# Altium schematic sheet 1VFAT_OH1_OCT1.SchDoc
size 420 x 297 mm
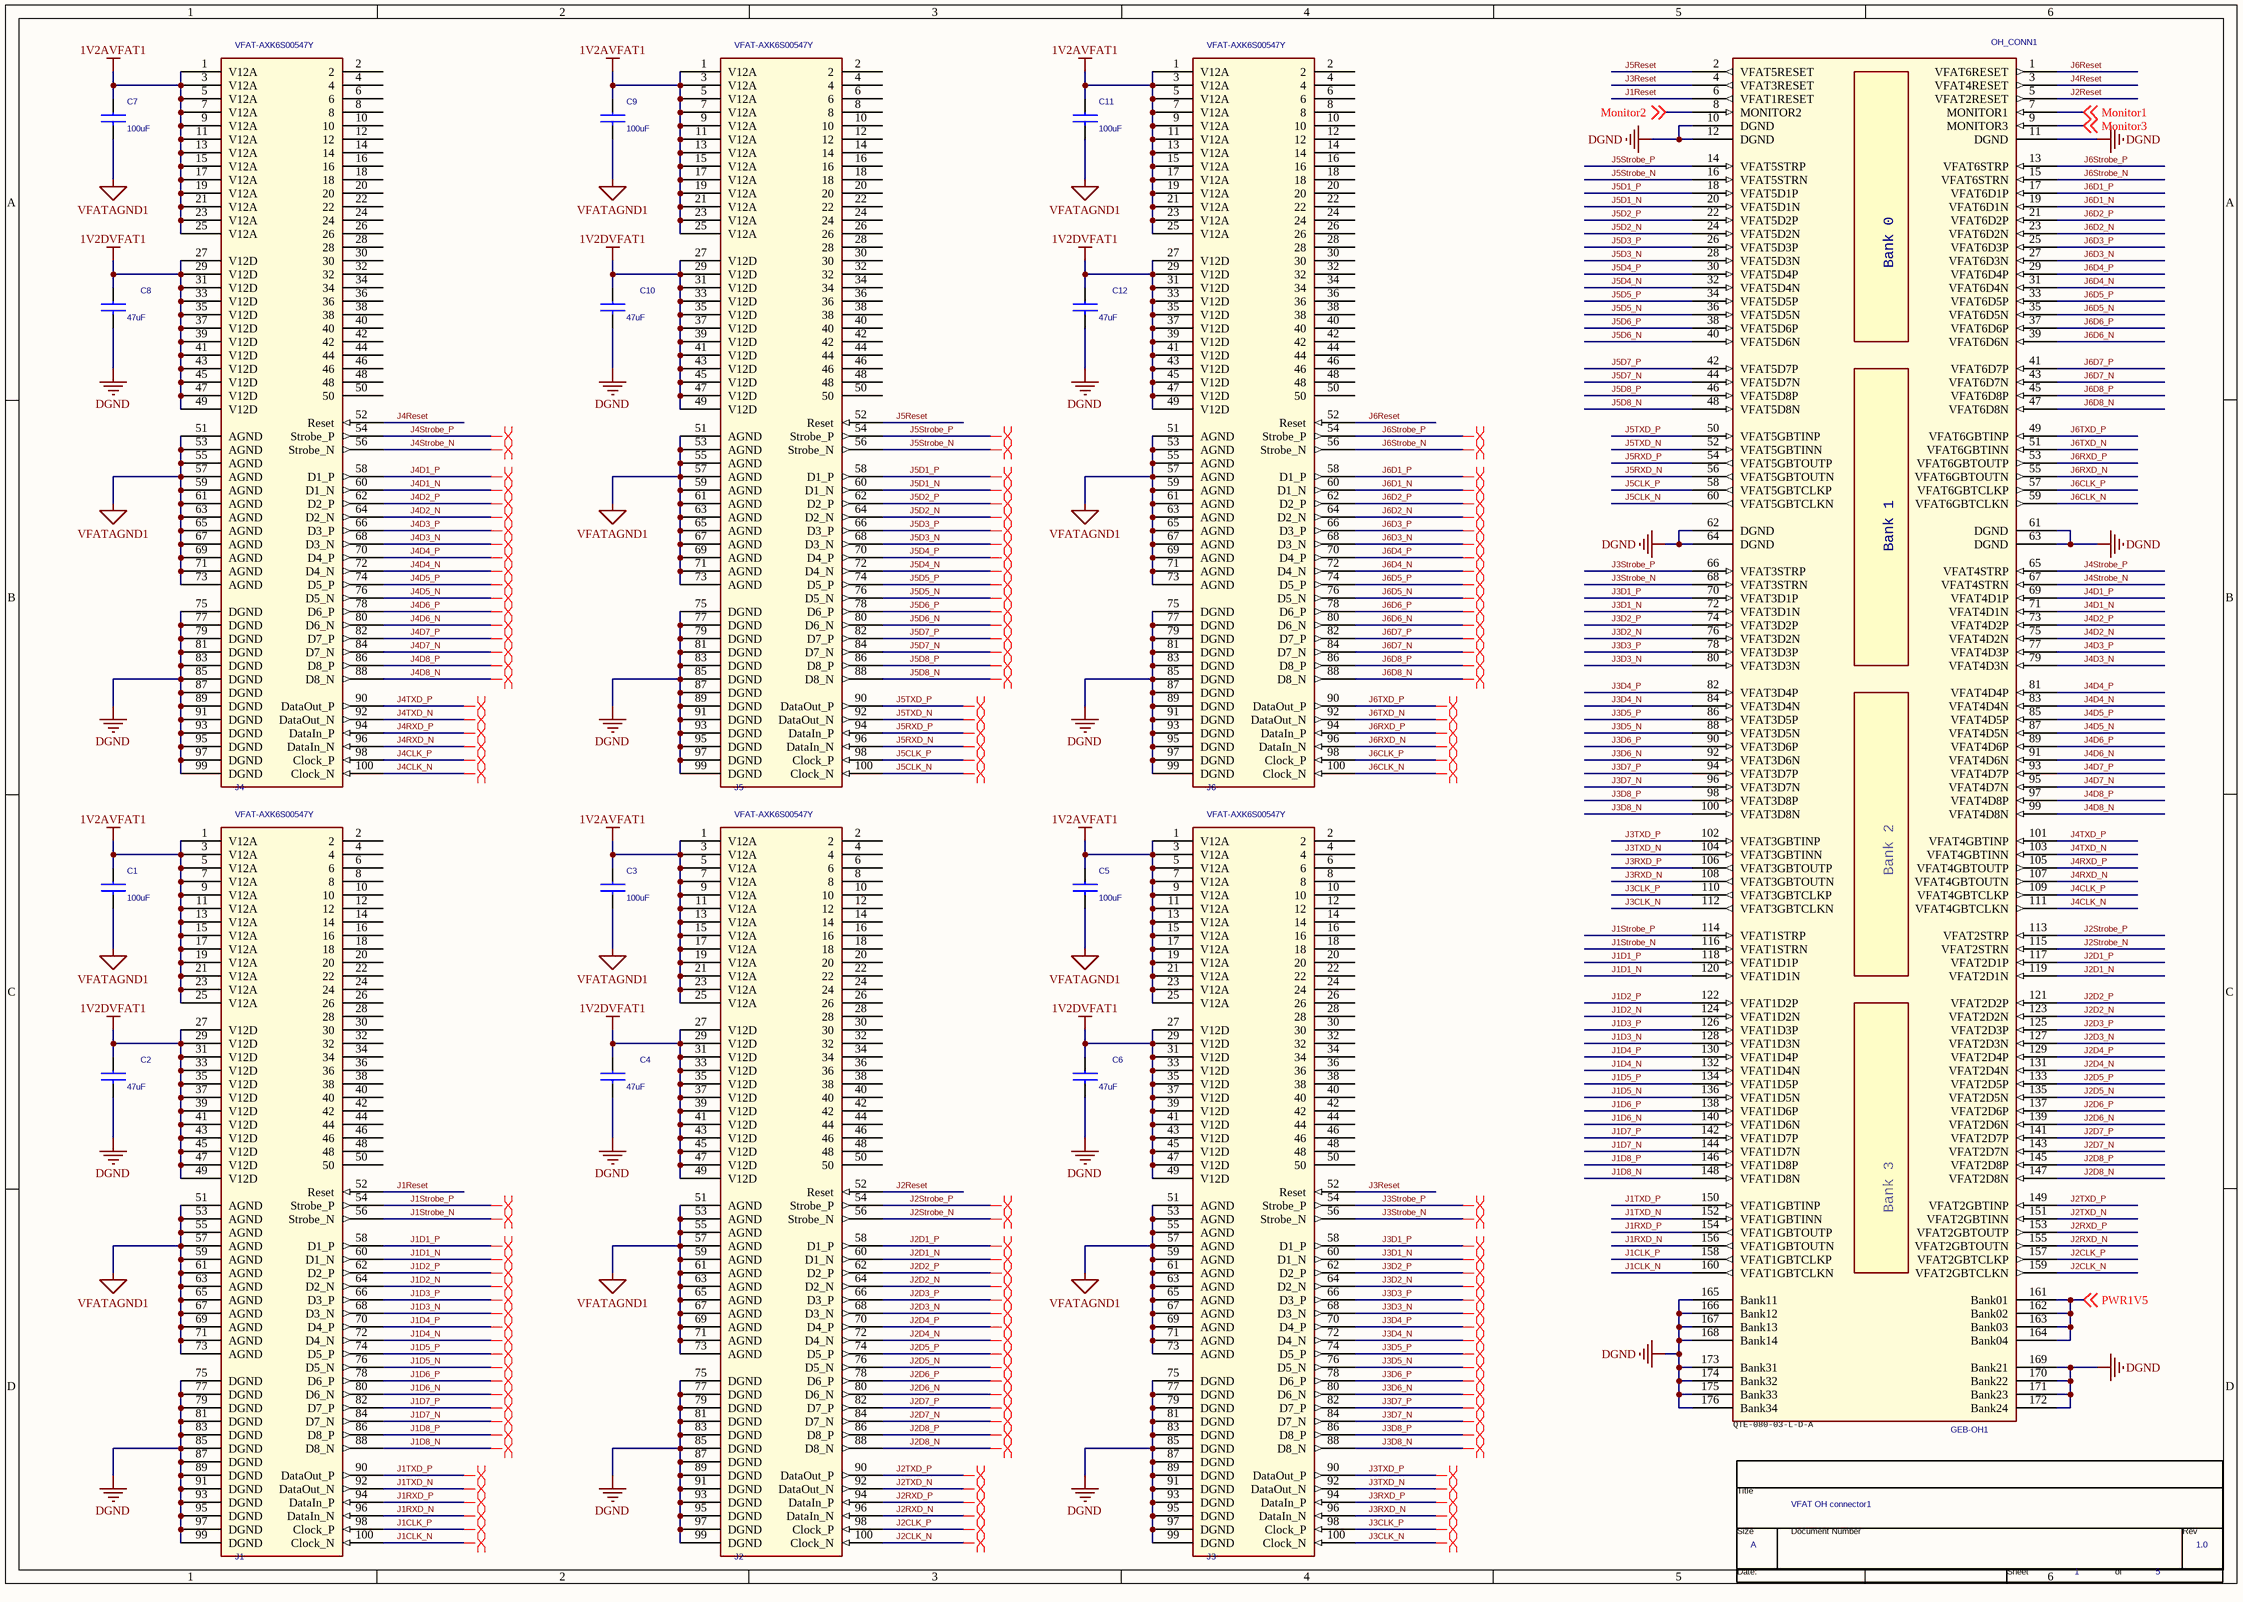
[diagram p0: 1VFAT_OH1_OCT1.SchDoc]

## Parts
*  Page Count: 5  Page Number: 1  Page Size: A  Title: VFAT OH connector1  RevCode: 1.0  (hidden comment: TitleBlock0)  (graphical)
C1  100uF  [C1210]
C2  47uF  [C1206]
C3  100uF  [C1210]
C4  47uF  [C1206]
C5  100uF  [C1210]
C6  47uF  [C1206]
C7  100uF  [C1210]
C8  47uF  [C1206]
C9  100uF  [C1210]
C10  47uF  [C1206]
C11  100uF  [C1210]
C12  47uF  [C1206]
J1  VFAT-AXK6S00547Y  [panasonic100]
J2  VFAT-AXK6S00547Y  [panasonic100]
J3  VFAT-AXK6S00547Y  [panasonic100]
J4  VFAT-AXK6S00547Y  [panasonic100]
J5  VFAT-AXK6S00547Y  [panasonic100]
J6  VFAT-AXK6S00547Y  [panasonic100]
OH_CONN1  GEB-OH1  [samtec160]

## Nets
1V2AVFAT1: C1.1 C3.1 C5.1 C7.1 C9.1 C11.1 J1.1(V12A) J1.3(V12A) J1.5(V12A) J1.7(V12A) J1.9(V12A) J1.11(V12A) J1.13(V12A) J1.15(V12A) J1.17(V12A) J1.19(V12A) J1.21(V12A) J1.23(V12A) J1.25(V12A) J2.1(V12A) J2.3(V12A) J2.5(V12A) J2.7(V12A) J2.9(V12A) J2.11(V12A) J2.13(V12A) J2.15(V12A) J2.17(V12A) J2.19(V12A) J2.21(V12A) J2.23(V12A) J2.25(V12A) J3.1(V12A) J3.3(V12A) J3.5(V12A) J3.7(V12A) J3.9(V12A) J3.11(V12A) J3.13(V12A) J3.15(V12A) J3.17(V12A) J3.19(V12A) J3.21(V12A) J3.23(V12A) J3.25(V12A) J4.1(V12A) J4.3(V12A) J4.5(V12A) J4.7(V12A) J4.9(V12A) J4.11(V12A) J4.13(V12A) J4.15(V12A) J4.17(V12A) J4.19(V12A) J4.21(V12A) J4.23(V12A) J4.25(V12A) J5.1(V12A) J5.3(V12A) J5.5(V12A) J5.7(V12A) J5.9(V12A) J5.11(V12A) J5.13(V12A) J5.15(V12A) J5.17(V12A) J5.19(V12A) J5.21(V12A) J5.23(V12A) J5.25(V12A) J6.1(V12A) J6.3(V12A) J6.5(V12A) J6.7(V12A) J6.9(V12A) J6.11(V12A) J6.13(V12A) J6.15(V12A) J6.17(V12A) J6.19(V12A) J6.21(V12A) J6.23(V12A) J6.25(V12A)
1V2DVFAT1: C2.1 C4.1 C6.1 C8.1 C10.1 C12.1 J1.27(V12D) J1.29(V12D) J1.31(V12D) J1.33(V12D) J1.35(V12D) J1.37(V12D) J1.39(V12D) J1.41(V12D) J1.43(V12D) J1.45(V12D) J1.47(V12D) J1.49(V12D) J2.27(V12D) J2.29(V12D) J2.31(V12D) J2.33(V12D) J2.35(V12D) J2.37(V12D) J2.39(V12D) J2.41(V12D) J2.43(V12D) J2.45(V12D) J2.47(V12D) J2.49(V12D) J3.27(V12D) J3.29(V12D) J3.31(V12D) J3.33(V12D) J3.35(V12D) J3.37(V12D) J3.39(V12D) J3.41(V12D) J3.43(V12D) J3.45(V12D) J3.47(V12D) J3.49(V12D) J4.27(V12D) J4.29(V12D) J4.31(V12D) J4.33(V12D) J4.35(V12D) J4.37(V12D) J4.39(V12D) J4.41(V12D) J4.43(V12D) J4.45(V12D) J4.47(V12D) J4.49(V12D) J5.27(V12D) J5.29(V12D) J5.31(V12D) J5.33(V12D) J5.35(V12D) J5.37(V12D) J5.39(V12D) J5.41(V12D) J5.43(V12D) J5.45(V12D) J5.47(V12D) J5.49(V12D) J6.27(V12D) J6.29(V12D) J6.31(V12D) J6.33(V12D) J6.35(V12D) J6.37(V12D) J6.39(V12D) J6.41(V12D) J6.43(V12D) J6.45(V12D) J6.47(V12D) J6.49(V12D)
DGND: C2.2 C4.2 C6.2 C8.2 C10.2 C12.2 J1.75(DGND) J1.77(DGND) J1.79(DGND) J1.81(DGND) J1.83(DGND) J1.85(DGND) J1.87(DGND) J1.89(DGND) J1.91(DGND) J1.93(DGND) J1.95(DGND) J1.97(DGND) J1.99(DGND) J2.75(DGND) J2.77(DGND) J2.79(DGND) J2.81(DGND) J2.83(DGND) J2.85(DGND) J2.87(DGND) J2.89(DGND) J2.91(DGND) J2.93(DGND) J2.95(DGND) J2.97(DGND) J2.99(DGND) J3.75(DGND) J3.77(DGND) J3.79(DGND) J3.81(DGND) J3.83(DGND) J3.85(DGND) J3.87(DGND) J3.89(DGND) J3.91(DGND) J3.93(DGND) J3.95(DGND) J3.97(DGND) J3.99(DGND) J4.75(DGND) J4.77(DGND) J4.79(DGND) J4.81(DGND) J4.83(DGND) J4.85(DGND) J4.87(DGND) J4.89(DGND) J4.91(DGND) J4.93(DGND) J4.95(DGND) J4.97(DGND) J4.99(DGND) J5.75(DGND) J5.77(DGND) J5.79(DGND) J5.81(DGND) J5.83(DGND) J5.85(DGND) J5.87(DGND) J5.89(DGND) J5.91(DGND) J5.93(DGND) J5.95(DGND) J5.97(DGND) J5.99(DGND) J6.75(DGND) J6.77(DGND) J6.79(DGND) J6.81(DGND) J6.83(DGND) J6.85(DGND) J6.87(DGND) J6.89(DGND) J6.91(DGND) J6.93(DGND) J6.95(DGND) J6.97(DGND) J6.99(DGND) OH_CONN1.10(DGND) OH_CONN1.11(DGND) OH_CONN1.12(DGND) OH_CONN1.61(DGND) OH_CONN1.62(DGND) OH_CONN1.63(DGND) OH_CONN1.64(DGND) OH_CONN1.165(Bank11) OH_CONN1.166(Bank12) OH_CONN1.167(Bank13) OH_CONN1.168(Bank14) OH_CONN1.169(Bank21) OH_CONN1.170(Bank22) OH_CONN1.171(Bank23) OH_CONN1.172(Bank24) OH_CONN1.173(Bank31) OH_CONN1.174(Bank32) OH_CONN1.175(Bank33) OH_CONN1.176(Bank34)
VFATAGND1: C1.2 C3.2 C5.2 C7.2 C9.2 C11.2 J1.51(AGND) J1.53(AGND) J1.55(AGND) J1.57(AGND) J1.59(AGND) J1.61(AGND) J1.63(AGND) J1.65(AGND) J1.67(AGND) J1.69(AGND) J1.71(AGND) J1.73(AGND) J2.51(AGND) J2.53(AGND) J2.55(AGND) J2.57(AGND) J2.59(AGND) J2.61(AGND) J2.63(AGND) J2.65(AGND) J2.67(AGND) J2.69(AGND) J2.71(AGND) J2.73(AGND) J3.51(AGND) J3.53(AGND) J3.55(AGND) J3.57(AGND) J3.59(AGND) J3.61(AGND) J3.63(AGND) J3.65(AGND) J3.67(AGND) J3.69(AGND) J3.71(AGND) J3.73(AGND) J4.51(AGND) J4.53(AGND) J4.55(AGND) J4.57(AGND) J4.59(AGND) J4.61(AGND) J4.63(AGND) J4.65(AGND) J4.67(AGND) J4.69(AGND) J4.71(AGND) J4.73(AGND) J5.51(AGND) J5.53(AGND) J5.55(AGND) J5.57(AGND) J5.59(AGND) J5.61(AGND) J5.63(AGND) J5.65(AGND) J5.67(AGND) J5.69(AGND) J5.71(AGND) J5.73(AGND) J6.51(AGND) J6.53(AGND) J6.55(AGND) J6.57(AGND) J6.59(AGND) J6.61(AGND) J6.63(AGND) J6.65(AGND) J6.67(AGND) J6.69(AGND) J6.71(AGND) J6.73(AGND)
J1CLK_N: J1.100(Clock_N) OH_CONN1.160(VFAT1GBTCLKN)
J1CLK_P: J1.98(Clock_P) OH_CONN1.158(VFAT1GBTCLKP)
J1D1_N: J1.60(D1_N) OH_CONN1.120(VFAT1D1N)
J1D1_P: J1.58(D1_P) OH_CONN1.118(VFAT1D1P)
J1D2_N: J1.64(D2_N) OH_CONN1.124(VFAT1D2N)
J1D2_P: J1.62(D2_P) OH_CONN1.122(VFAT1D2P)
J1D3_N: J1.68(D3_N) OH_CONN1.128(VFAT1D3N)
J1D3_P: J1.66(D3_P) OH_CONN1.126(VFAT1D3P)
J1D4_N: J1.72(D4_N) OH_CONN1.132(VFAT1D4N)
J1D4_P: J1.70(D4_P) OH_CONN1.130(VFAT1D4P)
J1D5_N: J1.76(D5_N) OH_CONN1.136(VFAT1D5N)
J1D5_P: J1.74(D5_P) OH_CONN1.134(VFAT1D5P)
J1D6_N: J1.80(D6_N) OH_CONN1.140(VFAT1D6N)
J1D6_P: J1.78(D6_P) OH_CONN1.138(VFAT1D6P)
J1D7_N: J1.84(D7_N) OH_CONN1.144(VFAT1D7N)
J1D7_P: J1.82(D7_P) OH_CONN1.142(VFAT1D7P)
J1D8_N: J1.88(D8_N) OH_CONN1.148(VFAT1D8N)
J1D8_P: J1.86(D8_P) OH_CONN1.146(VFAT1D8P)
J1Reset: J1.52(Reset) OH_CONN1.6(VFAT1RESET)
J1RXD_N: J1.96(DataIn_N) OH_CONN1.156(VFAT1GBTOUTN)
J1RXD_P: J1.94(DataIn_P) OH_CONN1.154(VFAT1GBTOUTP)
J1Strobe_N: J1.56(Strobe_N) OH_CONN1.116(VFAT1STRN)
J1Strobe_P: J1.54(Strobe_P) OH_CONN1.114(VFAT1STRP)
J1TXD_N: J1.92(DataOut_N) OH_CONN1.152(VFAT1GBTINN)
J1TXD_P: J1.90(DataOut_P) OH_CONN1.150(VFAT1GBTINP)
J2CLK_N: J2.100(Clock_N) OH_CONN1.159(VFAT2GBTCLKN)
J2CLK_P: J2.98(Clock_P) OH_CONN1.157(VFAT2GBTCLKP)
J2D1_N: J2.60(D1_N) OH_CONN1.119(VFAT2D1N)
J2D1_P: J2.58(D1_P) OH_CONN1.117(VFAT2D1P)
J2D2_N: J2.64(D2_N) OH_CONN1.123(VFAT2D2N)
J2D2_P: J2.62(D2_P) OH_CONN1.121(VFAT2D2P)
J2D3_N: J2.68(D3_N) OH_CONN1.127(VFAT2D3N)
J2D3_P: J2.66(D3_P) OH_CONN1.125(VFAT2D3P)
J2D4_N: J2.72(D4_N) OH_CONN1.131(VFAT2D4N)
J2D4_P: J2.70(D4_P) OH_CONN1.129(VFAT2D4P)
J2D5_N: J2.76(D5_N) OH_CONN1.135(VFAT2D5N)
J2D5_P: J2.74(D5_P) OH_CONN1.133(VFAT2D5P)
J2D6_N: J2.80(D6_N) OH_CONN1.139(VFAT2D6N)
J2D6_P: J2.78(D6_P) OH_CONN1.137(VFAT2D6P)
J2D7_N: J2.84(D7_N) OH_CONN1.143(VFAT2D7N)
J2D7_P: J2.82(D7_P) OH_CONN1.141(VFAT2D7P)
J2D8_N: J2.88(D8_N) OH_CONN1.147(VFAT2D8N)
J2D8_P: J2.86(D8_P) OH_CONN1.145(VFAT2D8P)
J2Reset: J2.52(Reset) OH_CONN1.5(VFAT2RESET)
J2RXD_N: J2.96(DataIn_N) OH_CONN1.155(VFAT2GBTOUTN)
J2RXD_P: J2.94(DataIn_P) OH_CONN1.153(VFAT2GBTOUTP)
J2Strobe_N: J2.56(Strobe_N) OH_CONN1.115(VFAT2STRN)
J2Strobe_P: J2.54(Strobe_P) OH_CONN1.113(VFAT2STRP)
J2TXD_N: J2.92(DataOut_N) OH_CONN1.151(VFAT2GBTINN)
J2TXD_P: J2.90(DataOut_P) OH_CONN1.149(VFAT2GBTINP)
J3CLK_N: J3.100(Clock_N) OH_CONN1.112(VFAT3GBTCLKN)
J3CLK_P: J3.98(Clock_P) OH_CONN1.110(VFAT3GBTCLKP)
J3D1_N: J3.60(D1_N) OH_CONN1.72(VFAT3D1N)
J3D1_P: J3.58(D1_P) OH_CONN1.70(VFAT3D1P)
J3D2_N: J3.64(D2_N) OH_CONN1.76(VFAT3D2N)
J3D2_P: J3.62(D2_P) OH_CONN1.74(VFAT3D2P)
J3D3_N: J3.68(D3_N) OH_CONN1.80(VFAT3D3N)
J3D3_P: J3.66(D3_P) OH_CONN1.78(VFAT3D3P)
J3D4_N: J3.72(D4_N) OH_CONN1.84(VFAT3D4N)
J3D4_P: J3.70(D4_P) OH_CONN1.82(VFAT3D4P)
J3D5_N: J3.76(D5_N) OH_CONN1.88(VFAT3D5N)
J3D5_P: J3.74(D5_P) OH_CONN1.86(VFAT3D5P)
J3D6_N: J3.80(D6_N) OH_CONN1.92(VFAT3D6N)
J3D6_P: J3.78(D6_P) OH_CONN1.90(VFAT3D6P)
J3D7_N: J3.84(D7_N) OH_CONN1.96(VFAT3D7N)
J3D7_P: J3.82(D7_P) OH_CONN1.94(VFAT3D7P)
J3D8_N: J3.88(D8_N) OH_CONN1.100(VFAT3D8N)
J3D8_P: J3.86(D8_P) OH_CONN1.98(VFAT3D8P)
J3Reset: J3.52(Reset) OH_CONN1.4(VFAT3RESET)
J3RXD_N: J3.96(DataIn_N) OH_CONN1.108(VFAT3GBTOUTN)
J3RXD_P: J3.94(DataIn_P) OH_CONN1.106(VFAT3GBTOUTP)
J3Strobe_N: J3.56(Strobe_N) OH_CONN1.68(VFAT3STRN)
J3Strobe_P: J3.54(Strobe_P) OH_CONN1.66(VFAT3STRP)
J3TXD_N: J3.92(DataOut_N) OH_CONN1.104(VFAT3GBTINN)
J3TXD_P: J3.90(DataOut_P) OH_CONN1.102(VFAT3GBTINP)
J4CLK_N: J4.100(Clock_N) OH_CONN1.111(VFAT4GBTCLKN)
J4CLK_P: J4.98(Clock_P) OH_CONN1.109(VFAT4GBTCLKP)
J4D1_N: J4.60(D1_N) OH_CONN1.71(VFAT4D1N)
J4D1_P: J4.58(D1_P) OH_CONN1.69(VFAT4D1P)
J4D2_N: J4.64(D2_N) OH_CONN1.75(VFAT4D2N)
J4D2_P: J4.62(D2_P) OH_CONN1.73(VFAT4D2P)
J4D3_N: J4.68(D3_N) OH_CONN1.79(VFAT4D3N)
J4D3_P: J4.66(D3_P) OH_CONN1.77(VFAT4D3P)
J4D4_N: J4.72(D4_N) OH_CONN1.83(VFAT4D4N)
J4D4_P: J4.70(D4_P) OH_CONN1.81(VFAT4D4P)
J4D5_N: J4.76(D5_N) OH_CONN1.87(VFAT4D5N)
J4D5_P: J4.74(D5_P) OH_CONN1.85(VFAT4D5P)
J4D6_N: J4.80(D6_N) OH_CONN1.91(VFAT4D6N)
J4D6_P: J4.78(D6_P) OH_CONN1.89(VFAT4D6P)
J4D7_N: J4.84(D7_N) OH_CONN1.95(VFAT4D7N)
J4D7_P: J4.82(D7_P) OH_CONN1.93(VFAT4D7P)
J4D8_N: J4.88(D8_N) OH_CONN1.99(VFAT4D8N)
J4D8_P: J4.86(D8_P) OH_CONN1.97(VFAT4D8P)
J4Reset: J4.52(Reset) OH_CONN1.3(VFAT4RESET)
J4RXD_N: J4.96(DataIn_N) OH_CONN1.107(VFAT4GBTOUTN)
J4RXD_P: J4.94(DataIn_P) OH_CONN1.105(VFAT4GBTOUTP)
J4Strobe_N: J4.56(Strobe_N) OH_CONN1.67(VFAT4STRN)
J4Strobe_P: J4.54(Strobe_P) OH_CONN1.65(VFAT4STRP)
J4TXD_N: J4.92(DataOut_N) OH_CONN1.103(VFAT4GBTINN)
J4TXD_P: J4.90(DataOut_P) OH_CONN1.101(VFAT4GBTINP)
J5CLK_N: J5.100(Clock_N) OH_CONN1.60(VFAT5GBTCLKN)
J5CLK_P: J5.98(Clock_P) OH_CONN1.58(VFAT5GBTCLKP)
J5D1_N: J5.60(D1_N) OH_CONN1.20(VFAT5D1N)
J5D1_P: J5.58(D1_P) OH_CONN1.18(VFAT5D1P)
J5D2_N: J5.64(D2_N) OH_CONN1.24(VFAT5D2N)
J5D2_P: J5.62(D2_P) OH_CONN1.22(VFAT5D2P)
J5D3_N: J5.68(D3_N) OH_CONN1.28(VFAT5D3N)
J5D3_P: J5.66(D3_P) OH_CONN1.26(VFAT5D3P)
J5D4_N: J5.72(D4_N) OH_CONN1.32(VFAT5D4N)
J5D4_P: J5.70(D4_P) OH_CONN1.30(VFAT5D4P)
J5D5_N: J5.76(D5_N) OH_CONN1.36(VFAT5D5N)
J5D5_P: J5.74(D5_P) OH_CONN1.34(VFAT5D5P)
J5D6_N: J5.80(D6_N) OH_CONN1.40(VFAT5D6N)
J5D6_P: J5.78(D6_P) OH_CONN1.38(VFAT5D6P)
J5D7_N: J5.84(D7_N) OH_CONN1.44(VFAT5D7N)
J5D7_P: J5.82(D7_P) OH_CONN1.42(VFAT5D7P)
J5D8_N: J5.88(D8_N) OH_CONN1.48(VFAT5D8N)
J5D8_P: J5.86(D8_P) OH_CONN1.46(VFAT5D8P)
J5Reset: J5.52(Reset) OH_CONN1.2(VFAT5RESET)
J5RXD_N: J5.96(DataIn_N) OH_CONN1.56(VFAT5GBTOUTN)
J5RXD_P: J5.94(DataIn_P) OH_CONN1.54(VFAT5GBTOUTP)
J5Strobe_N: J5.56(Strobe_N) OH_CONN1.16(VFAT5STRN)
J5Strobe_P: J5.54(Strobe_P) OH_CONN1.14(VFAT5STRP)
J5TXD_N: J5.92(DataOut_N) OH_CONN1.52(VFAT5GBTINN)
J5TXD_P: J5.90(DataOut_P) OH_CONN1.50(VFAT5GBTINP)
J6CLK_N: J6.100(Clock_N) OH_CONN1.59(VFAT6GBTCLKN)
J6CLK_P: J6.98(Clock_P) OH_CONN1.57(VFAT6GBTCLKP)
J6D1_N: J6.60(D1_N) OH_CONN1.19(VFAT6D1N)
J6D1_P: J6.58(D1_P) OH_CONN1.17(VFAT6D1P)
J6D2_N: J6.64(D2_N) OH_CONN1.23(VFAT6D2N)
J6D2_P: J6.62(D2_P) OH_CONN1.21(VFAT6D2P)
J6D3_N: J6.68(D3_N) OH_CONN1.27(VFAT6D3N)
J6D3_P: J6.66(D3_P) OH_CONN1.25(VFAT6D3P)
J6D4_N: J6.72(D4_N) OH_CONN1.31(VFAT6D4N)
J6D4_P: J6.70(D4_P) OH_CONN1.29(VFAT6D4P)
J6D5_N: J6.76(D5_N) OH_CONN1.35(VFAT6D5N)
J6D5_P: J6.74(D5_P) OH_CONN1.33(VFAT6D5P)
J6D6_N: J6.80(D6_N) OH_CONN1.39(VFAT6D6N)
J6D6_P: J6.78(D6_P) OH_CONN1.37(VFAT6D6P)
J6D7_N: J6.84(D7_N) OH_CONN1.43(VFAT6D7N)
J6D7_P: J6.82(D7_P) OH_CONN1.41(VFAT6D7P)
J6D8_N: J6.88(D8_N) OH_CONN1.47(VFAT6D8N)
J6D8_P: J6.86(D8_P) OH_CONN1.45(VFAT6D8P)
J6Reset: J6.52(Reset) OH_CONN1.1(VFAT6RESET)
J6RXD_N: J6.96(DataIn_N) OH_CONN1.55(VFAT6GBTOUTN)
J6RXD_P: J6.94(DataIn_P) OH_CONN1.53(VFAT6GBTOUTP)
J6Strobe_N: J6.56(Strobe_N) OH_CONN1.15(VFAT6STRN)
J6Strobe_P: J6.54(Strobe_P) OH_CONN1.13(VFAT6STRP)
J6TXD_N: J6.92(DataOut_N) OH_CONN1.51(VFAT6GBTINN)
J6TXD_P: J6.90(DataOut_P) OH_CONN1.49(VFAT6GBTINP)
Monitor1: OH_CONN1.7(MONITOR1) ; off-sheet Monitor1
Monitor2: OH_CONN1.8(MONITOR2) ; off-sheet Monitor2
Monitor3: OH_CONN1.9(MONITOR3) ; off-sheet Monitor3
PWR1V5: OH_CONN1.161(Bank01) OH_CONN1.162(Bank02) OH_CONN1.163(Bank03) OH_CONN1.164(Bank04) ; off-sheet PWR1V5

Not connected (* = marked no-connect by the designer): J1 2 4 6 8 10 12 14 16 18 20 22 24 26 28 30 32 34 36 38 40 42 44 46 48 50; J2 2 4 6 8 10 12 14 16 18 20 22 24 26 28 30 32 34 36 38 40 42 44 46 48 50; J3 2 4 6 8 10 12 14 16 18 20 22 24 26 28 30 32 34 36 38 40 42 44 46 48 50; J4 2 4 6 8 10 12 14 16 18 20 22 24 26 28 30 32 34 36 38 40 42 44 46 48 50; J5 2 4 6 8 10 12 14 16 18 20 22 24 26 28 30 32 34 36 38 40 42 44 46 48 50; J6 2 4 6 8 10 12 14 16 18 20 22 24 26 28 30 32 34 36 38 40 42 44 46 48 50

## Layout directives
differential pair: J1CLK_N, J1CLK_P, J1D1_N, J1D1_P, J1D2_N, J1D2_P, J1D3_N, J1D3_P, J1D4_N, J1D4_P, J1D5_N, J1D5_P, J1D6_N, J1D6_P, J1D7_N, J1D7_P, J1D8_N, J1D8_P, J1RXD_N, J1RXD_P, J1Strobe_N, J1Strobe_P, J1TXD_N, J1TXD_P, J2CLK_N, J2CLK_P, J2D1_N, J2D1_P, J2D2_N, J2D2_P, J2D3_N, J2D3_P, J2D4_N, J2D4_P, J2D5_N, J2D5_P, J2D6_N, J2D6_P, J2D7_N, J2D7_P, J2D8_N, J2D8_P, J2RXD_N, J2RXD_P, J2Strobe_N, J2Strobe_P, J2TXD_N, J2TXD_P, J3CLK_N, J3CLK_P, J3D1_N, J3D1_P, J3D2_N, J3D2_P, J3D3_N, J3D3_P, J3D4_N, J3D4_P, J3D5_N, J3D5_P, J3D6_N, J3D6_P, J3D7_N, J3D7_P, J3D8_N, J3D8_P, J3RXD_N, J3RXD_P, J3Strobe_N, J3Strobe_P, J3TXD_N, J3TXD_P, J4CLK_N, J4CLK_P, J4D1_N, J4D1_P, J4D2_N, J4D2_P, J4D3_N, J4D3_P, J4D4_N, J4D4_P, J4D5_N, J4D5_P, J4D6_N, J4D6_P, J4D7_N, J4D7_P, J4D8_N, J4D8_P, J4RXD_N, J4RXD_P, J4Strobe_N, J4Strobe_P, J4TXD_N, J4TXD_P, J5CLK_N, J5CLK_P, J5D1_N, J5D1_P, J5D2_N, J5D2_P, J5D3_N, J5D3_P, J5D4_N, J5D4_P, J5D5_N, J5D5_P, J5D6_N, J5D6_P, J5D7_N, J5D7_P, J5D8_N, J5D8_P, J5RXD_N, J5RXD_P, J5Strobe_N, J5Strobe_P, J5TXD_N, J5TXD_P, J6CLK_N, J6CLK_P, J6D1_N, J6D1_P, J6D2_N, J6D2_P, J6D3_N, J6D3_P, J6D4_N, J6D4_P, J6D5_N, J6D5_P, J6D6_N, J6D6_P, J6D7_N, J6D7_P, J6D8_N, J6D8_P, J6RXD_N, J6RXD_P, J6Strobe_N, J6Strobe_P, J6TXD_N, J6TXD_P

## Notes on the sheet
- (near OH_CONN1) QTE-080-03-L-D-A
- (in symbol GEB-OH1) Bank 0; Bank 1; Bank 2; Bank 3
- (in symbol TitleBlock0) Title; Size; Document Number; Rev; Date:; Sheet; of

## Library data of the parts
C1-C12 = CAP NP
* = TitleBlock0: Page Create Date: March  8, 1995